# EAGLE design xv11_nucleo_shield (EAGLE 8.1.0)
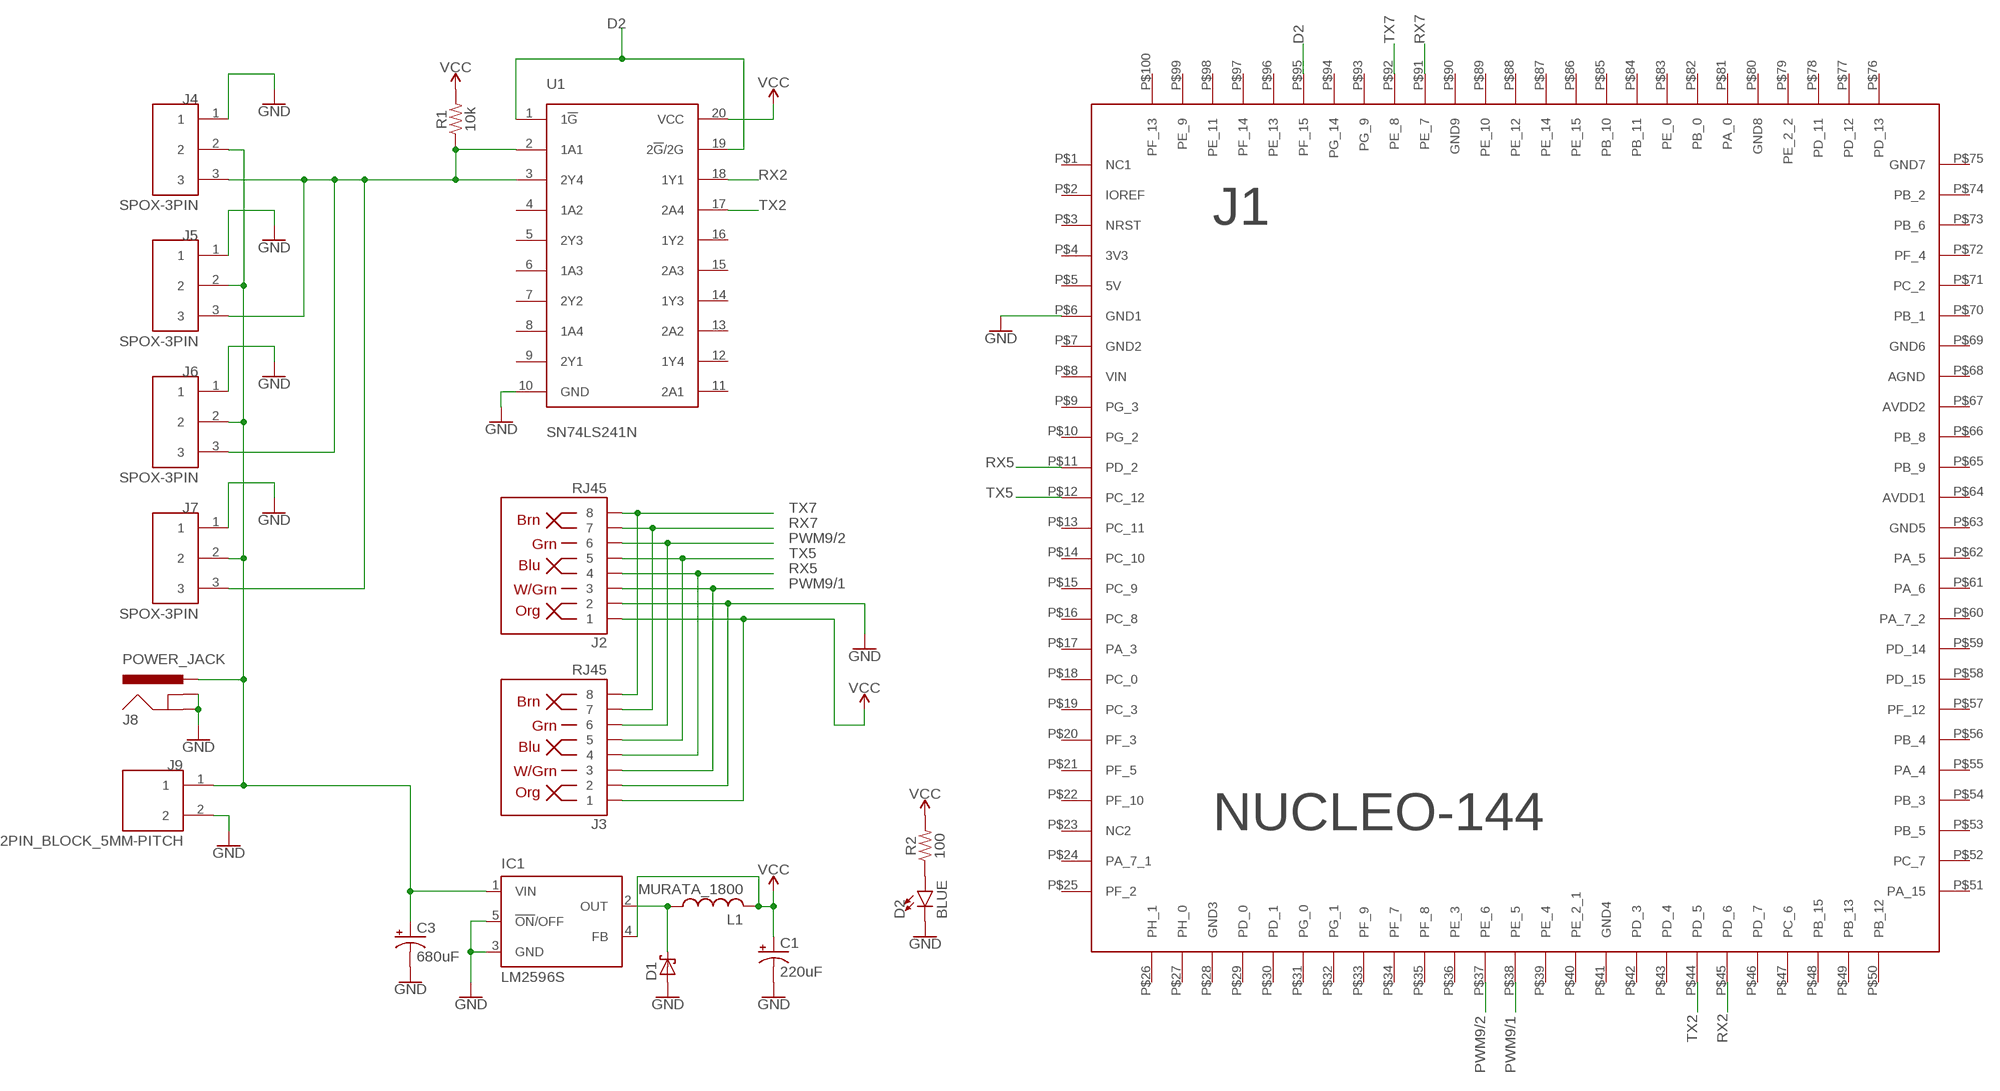
[diagram p0: schematic, sheet 1]

## Parts
C1  220uF  100UF-POLAR-RADIAL-2.5MM-25V-20%  [CPOL-RADIAL-2.5MM-6.5MM]
C3  680uF  EEU-FR1C681L  [EEU-FR1C681L]
D1  SCHOTTKY-DIODEDO201T15  [DO201T15]
D2  BLUE  LED-BLUE1206  [LED-1206]
IC1  LM2596S  [TO263-5]
J1  NUCLEO-144  [NUCLEO-144]
J2  RJ45  RJ45-8  [RJ45-8]
J3  RJ45  RJ45-8  [RJ45-8]
J4  SPOX-3PIN  [SPOX-3PIN]
J5  SPOX-3PIN  [SPOX-3PIN]
J6  SPOX-3PIN  [SPOX-3PIN]
J7  SPOX-3PIN  [SPOX-3PIN]
J8  POWER_JACK  [POWER_JACK_PTH]
J9  2PIN_BLOCK_5MM-PITCH  [2PIN_BLOCK_5MM-PITCH]
L1  MURATA_1800  [MURATA_1800]
R1  10k  10KOHM-HORIZ-1/4W-1%  [AXIAL-0.3]
R2  100  10KOHM-HORIZ-1/4W-1%  [AXIAL-0.3]
U1  SN74LS241N  [DIL20]

## Nets
D2: J1.P$95(PF_15) U1.1(1!G) U1.19(2!G!/2G)
GND: C1.2(-) C3.P$2(-) D1.A D2.C IC1.3(GND) IC1.5(!ON!/OFF) J1.P$6(GND1) J2.2 J3.2 J4.1 J5.1 J6.1 J7.1 J8.GND J8.GNDBREAK J9.2 U1.10(GND)
N$1: J4.3 J5.3 J6.3 J7.3 R1.P$1 U1.2(1A1) U1.3(2Y4)
N$2: C3.P$1(+) IC1.1(VIN) J4.2 J5.2 J6.2 J7.2 J8.PWR J9.1
N$3: D1.C IC1.2(OUT) L1.P$1
N$4: D2.A R2.P$1
PWM9/1: J1.P$38(PE_5) J2.3 J3.3
PWM9/2: J1.P$37(PE_6) J2.6 J3.6
RX2: J1.P$45(PD_6) U1.18(1Y1)
RX5: J1.P$11(PD_2) J2.4 J3.4
RX7: J1.P$91(PE_7) J2.7 J3.7
TX2: J1.P$44(PD_5) U1.17(2A4)
TX5: J1.P$12(PC_12) J2.5 J3.5
TX7: J1.P$92(PE_8) J2.8 J3.8
VCC: C1.1(+) IC1.4(FB) J2.1 J3.1 L1.P$2 R1.P$2 R2.P$2 U1.20(VCC)
Unconnected: J1.P$1(NC1) J1.P$2(IOREF) J1.P$3(NRST) J1.P$4(3V3) J1.P$5(5V) J1.P$7(GND2) J1.P$8(VIN) J1.P$9(PG_3) J1.P$10(PG_2) J1.P$13(PC_11) J1.P$14(PC_10) J1.P$15(PC_9) J1.P$16(PC_8) J1.P$17(PA_3) J1.P$18(PC_0) J1.P$19(PC_3) J1.P$20(PF_3) J1.P$21(PF_5) J1.P$22(PF_10) J1.P$23(NC2) J1.P$24(PA_7_1) J1.P$25(PF_2) J1.P$26(PH_1) J1.P$27(PH_0) J1.P$28(GND3) J1.P$29(PD_0) J1.P$30(PD_1) J1.P$31(PG_0) J1.P$32(PG_1) J1.P$33(PF_9) J1.P$34(PF_7) J1.P$35(PF_8) J1.P$36(PE_3) J1.P$39(PE_4) J1.P$40(PE_2_1) J1.P$41(GND4) J1.P$42(PD_3) J1.P$43(PD_4) J1.P$46(PD_7) J1.P$47(PC_6) J1.P$48(PB_15) J1.P$49(PB_13) J1.P$50(PB_12) J1.P$51(PA_15) J1.P$52(PC_7) J1.P$53(PB_5) J1.P$54(PB_3) J1.P$55(PA_4) J1.P$56(PB_4) J1.P$57(PF_12) J1.P$58(PD_15) J1.P$59(PD_14) J1.P$60(PA_7_2) J1.P$61(PA_6) J1.P$62(PA_5) J1.P$63(GND5) J1.P$64(AVDD1) J1.P$65(PB_9) J1.P$66(PB_8) J1.P$67(AVDD2) J1.P$68(AGND) J1.P$69(GND6) J1.P$70(PB_1) J1.P$71(PC_2) J1.P$72(PF_4) J1.P$73(PB_6) J1.P$74(PB_2) J1.P$75(GND7) J1.P$76(PD_13) J1.P$77(PD_12) J1.P$78(PD_11) J1.P$79(PE_2_2) J1.P$80(GND8) J1.P$81(PA_0) J1.P$82(PB_0) J1.P$83(PE_0) J1.P$84(PB_11) J1.P$85(PB_10) J1.P$86(PE_15) J1.P$87(PE_14) J1.P$88(PE_12) J1.P$89(PE_10) J1.P$90(GND9) J1.P$93(PG_9) J1.P$94(PG_14) J1.P$96(PE_13) J1.P$97(PF_14) J1.P$98(PE_11) J1.P$99(PE_9) J1.P$100(PF_13) U1.4(1A2) U1.5(2Y3) U1.6(1A3) U1.7(2Y2) U1.8(1A4) U1.9(2Y1) U1.11(2A1) U1.12(1Y4) U1.13(2A2) U1.14(1Y3) U1.15(2A3) U1.16(1Y2)

## Library data of the parts
C1 = SparkFun-Capacitors:100UF-POLAR: 100µF polarized capacitors A capacitor is a passive two-terminal electrical component used to store electrical energy temporarily in an electric field.; PROD_ID: CAP-08439; VALUE: 100uF
C3 = Nucleo-144:EEU-FR1C681L: Panasonic Aluminum Electrolytic Capacitor Radial 16V 680uF
D1 = adafruit:SCHOTTKY-DIODE: Schottky Diode
D2 = SparkFun-LED:LED-BLUE: Blue SMD LED Used in manufacturing of various products at SparkFun Packages: 0603 - SMD 0603 package [Product Link] <http://www.digikey.com/product-detail/en/SMLE12BC7TT86/511-1589-2-ND/1641808> 1206 - SMD1206 package [Product Link] <http://www.digikey.com/product-detail/en/lite-on-inc/LTST-C150TBKT/160-1643-1-ND/573584> SparkFun Products: ESP8266 Thing-Dev Board <https://www.sparkfun.com/products/13711> RedBoard <https://www.sparkfun.com/products/12757>; PROD_ID: DIO-09911
IC1 = national-semiconductor:LM2596: SIMPLE SWITCHER® Power Converter 150 kHz 3A Step-Down Voltage Regulator Source: http://www.national.com/ds/LM/LM2596.pdf; MF: NATIONAL SEMICONDUCTOR; MPN: LM2596S-ADJ/NOPB; OC_FARNELL: 9494367; OC_NEWARK: 41K3842
J1 = Nucleo-144:NUCLEO-144: Header footprint of an STM32 Nucleo 144 pin board for use in making shields for the board.
J2 J3 = SparkFun-Connectors:RJ45-8: RJ45 Jack - 8 pin Simple RJ45, 8-pin connection. Commonly used for Cat5, Cat5e, and Cat6 Ethernet cables. Here is the connector we sell at SparkFun: RJ45 8-Pin Connector <https://www.sparkfun.com/products/643> (PRT-00643) Datasheet <https://cdn.sparkfun.com/datasheets/Prototyping/04908.pdf> It is used on this SparkFun product: SparkFun RJ45 Breakout <https://www.sparkfun.com/products/716> (BOB-00716) Note, you may also be interested in the "MAGJACK" version of this. It is basically a RJ45 connector, but also has some status LEDs built into the connector housing. You can check that out in this library at the device named "MAGJACK.dev" and see these products online: RJ45 Ethernet MagJack-Compatible <https://www.sparkfun.com/products/8534> (PRT-08534) SparkFun RJ45 MagJack Breakout <https://www.sparkfun.com/products/13021> (BOB-13021); PROD_ID: CONN-08506; SF_ID: PRT-00643
J4-J7 = Nucleo-144:SPOX-3PIN: 3-pin MOLEX SPOX connector.
J8 = SparkFun-Connectors:POWER_JACK: Power Jack Connector This is the standard 5.5mm barrel jack for power. The PTH is the most common, proven, reliable, footprint. The Slot footprint only works if the mill layer is transmitted to the PCB fab house so be warned. Here are the connectors we sell at SparkFun: DC Barrel Power Jack/Connector <https://www.sparkfun.com/products/119> (PRT-00119) DC Barrel Power Jack/Connector (SMD) <https://www.sparkfun.com/products/12748> (PRT-12748) DC Barrel Jack Adapter - Breadboard Compatible <https://www.sparkfun.com/products/10811> (PRT-10811) It is used on this SparkFun product (and many, many others): SparkFun RedBoard - Programmed with Arduino <https://www.sparkfun.com/products/12757> (DEV-12757) Also, if you need a mating power supply or connector, please check these out: Wall Adapter Power Supply - 9VDC 650mA <https://www.sparkfun.com/products/298> (TOL-00298) DC Barrel Jack Adapter - Male <https://www.sparkfun.com/products/10287> (PRT-10287); PROD_ID: CONN-08197
J9 = Nucleo-144:2PIN_BLOCK_5MM-PITCH
L1 = Nucleo-144:MURATA_1800: Murata 1800 Series Axial Inductor
R1 = SparkFun-Resistors:10KOHM: 10kΩ resistor A resistor is a passive two-terminal electrical component that implements electrical resistance as a circuit element. Resistors act to reduce current flow, and, at the same time, act to lower voltage levels within circuits. - Wikipedia; PROD_ID: RES-12183
R2 = SparkFun-Resistors:10KOHM: 10kΩ resistor A resistor is a passive two-terminal electrical component that implements electrical resistance as a circuit element. Resistors act to reduce current flow, and, at the same time, act to lower voltage levels within circuits. - Wikipedia; PROD_ID: RES-12183; VALUE: 10k
U1 = Nucleo-144:SN74LS241N: Octal Line Buffer

## Board
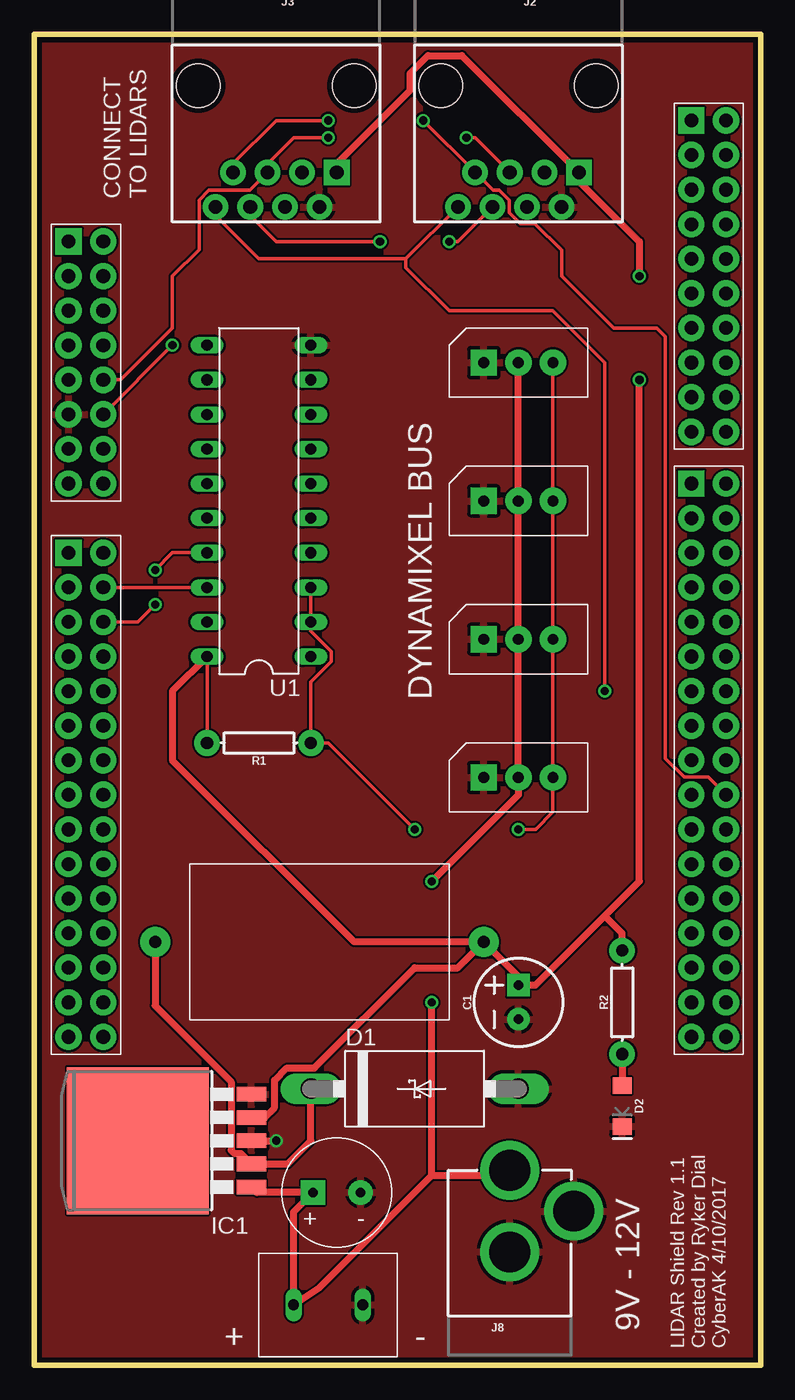
[diagram p1: board, top side]
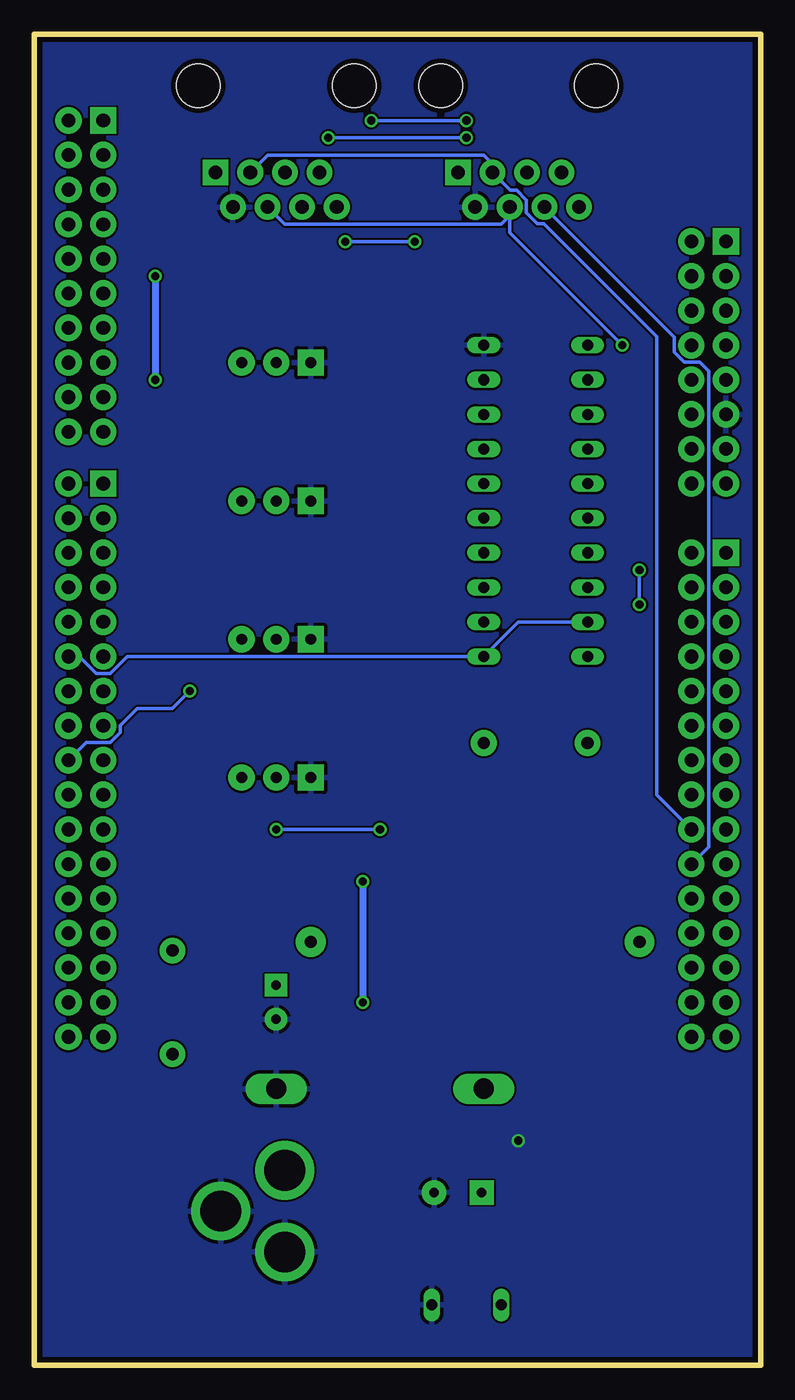
[diagram p2: board, bottom side, seen from below]

Size 53.34 x 97.79 mm. Coordinates in mm from the lower left corner, seen from the top.
Outline: 0,0 0,97.79 53.34,97.79 53.34,0 0,0
Copper layers (1*16): Top 0.0356mm / dielectric 1.5011mm / Bottom 0.0356mm
Design rules "LaenPCBOrder": minimum track width 6mil, minimum drill 13mil, track to track 6mil, track to pad 6mil, pad to pad 6mil, via to via 6mil, smd to smd 6mil, copper to edge 15mil, drill to drill 6mil, minimum pad ring 7mil, minimum via ring 7mil, stop-mask expansion 3mil, vias tented up to drill 0mil, thermal gap 10mil

### Footprints (pad centres in the part's own frame; a part is rotated, then mirrored left to right if it is on the bottom)
CPOL-RADIAL-2.5MM-6.5MM = drill 0.7 pad 1.651 square: 1 1.25,0 | drill 0.7 pad 1.651: 2 -1.25,0
EEU-FR1C681L = drill 0.7 pad 1.778 square: P$1 -1.75,0 | drill 0.7 pad 1.778: P$2 1.75,0
DO201T15 = drill 1.499 long: A 7.62,0; C -7.62,0
LED-1206 = smd 1.2 x 1.4: A -1.5,0; C 1.5,0
TO263-5 = smd 1.067 x 2.159: 1 -3.404,-5.791; 2 -1.702,-5.791; 3 0,-5.791; 4 1.702,-5.791; 5 3.404,-5.791 | smd 10.8 x 10.41: 6 0,2.54
NUCLEO-144 = drill 1 pad 1.93 square: P$1 0,0; P$17 0,-22.86; P$47 45.72,8.89; P$67 45.72,-17.78 | drill 1 pad 1.93: P$2 0,-2.54; P$3 0,-5.08; P$4 0,-7.62; P$5 0,-10.16; P$6 0,-12.7; P$7 0,-15.24; P$8 0,-17.78; P$9 2.54,-17.78; P$10 2.54,-15.24; P$11 2.54,-12.7; P$12 2.54,-10.16; P$13 2.54,-7.62; P$14 2.54,-5.08; P$15 2.54,-2.54; P$16 2.54,0; P$18 0,-25.4; P$19 0,-27.94; P$20 0,-30.48; P$21 0,-33.02; P$22 0,-35.56; P$23 0,-38.1; P$24 0,-40.64; P$25 0,-43.18; P$26 0,-45.72; P$27 0,-48.26; P$28 0,-50.8; P$29 0,-53.34; P$30 0,-55.88; P$31 0,-58.42; P$32 2.54,-58.42; P$33 2.54,-55.88; P$34 2.54,-53.34; P$35 2.54,-50.8; P$36 2.54,-48.26; P$37 2.54,-45.72; P$38 2.54,-43.18; P$39 2.54,-40.64; P$40 2.54,-38.1; P$41 2.54,-35.56; P$42 2.54,-33.02; P$43 2.54,-30.48; P$44 2.54,-27.94; P$45 2.54,-25.4; P$46 2.54,-22.86; P$48 45.72,6.35; P$49 45.72,3.81; P$50 45.72,1.27; P$51 45.72,-1.27; P$52 45.72,-3.81; P$53 45.72,-6.35; P$54 45.72,-8.89; P$55 45.72,-11.43; P$56 45.72,-13.97; P$57 48.26,-13.97; P$58 48.26,-11.43; P$59 48.26,-8.89; P$60 48.26,-6.35; P$61 48.26,-3.81; P$62 48.26,-1.27; P$63 48.26,1.27; P$64 48.26,3.81; P$65 48.26,6.35; P$66 48.26,8.89; P$68 45.72,-20.32; P$69 45.72,-22.86; P$70 45.72,-25.4; P$71 45.72,-27.94; P$72 45.72,-30.48; P$73 45.72,-33.02; P$74 45.72,-35.56; P$75 45.72,-38.1; P$76 45.72,-40.64; P$77 45.72,-43.18; P$78 45.72,-45.72; P$79 45.72,-48.26; P$80 45.72,-50.8; P$81 45.72,-53.34; P$82 45.72,-55.88; P$83 45.72,-58.42; P$84 48.26,-58.42; P$85 48.26,-55.88; P$86 48.26,-53.34; P$87 48.26,-50.8; P$88 48.26,-48.26; P$89 48.26,-45.72; P$90 48.26,-43.18; P$91 48.26,-40.64; P$92 48.26,-38.1; P$93 48.26,-35.56; P$94 48.26,-33.02; P$95 48.26,-30.48; P$96 48.26,-27.94; P$97 48.26,-25.4; P$98 48.26,-22.86; P$99 48.26,-20.32; P$100 48.26,-17.78
RJ45-8 = drill 1 pad 1.88 square: 1 -4.445,6.35 | drill 1 pad 1.88: 2 -3.175,8.89; 3 -1.905,6.35; 4 -0.635,8.89; 5 0.635,6.35; 6 1.905,8.89; 7 3.175,6.35; 8 4.445,8.89 | hole 3.2: -5.715,0; 5.715,0
SPOX-3PIN = drill 0.8 pad 1.93 square: 1 2.54,2.54 | drill 0.8 pad 1.93: 2 5.08,2.54; 3 7.62,2.54
POWER_JACK_PTH = drill 2.997 pad 4.318: GND 0,7.7; GNDBREAK 4.7,10.7; PWR 0,13.7
2PIN_BLOCK_5MM-PITCH = drill 0.8 long: 1 2.54,3.81; 2 7.62,3.81
MURATA_1800 = drill 0.9 pad 2.184: P$1 -2.54,5.715; P$2 21.59,5.715
AXIAL-0.3 = drill 0.9 pad 1.88: P$1 -3.81,0; P$2 3.81,0
DIL20 = drill 0.813 long: 1 -11.43,-3.81; 2 -8.89,-3.81; 3 -6.35,-3.81; 4 -3.81,-3.81; 5 -1.27,-3.81; 6 1.27,-3.81; 7 3.81,-3.81; 8 6.35,-3.81; 9 8.89,-3.81; 10 11.43,-3.81; 11 11.43,3.81; 12 8.89,3.81; 13 6.35,3.81; 14 3.81,3.81; 15 1.27,3.81; 16 -1.27,3.81; 17 -3.81,3.81; 18 -6.35,3.81; 19 -8.89,3.81; 20 -11.43,3.81

### Placement (x,y rotation side)
C1  35.56,26.67 90 top
C3  22.23,12.7 0 top
D1  27.94,20.32 0 top
D2  43.18,19.05 270 top
IC1  10.16,16.51 90 top
J1  2.54,82.55 0 top
J2  35.56,93.98 180 top
J3  17.78,93.98 180 top
J4  30.48,71.12 0 top
J5  30.48,60.96 0 top
J6  30.48,50.8 0 top
J7  30.48,40.64 0 top
J8  34.92,0.64 0 top
J9  16.51,0.64 0 top
L1  11.43,25.4 0 top
R1  16.51,45.72 180 top
R2  43.18,26.67 90 top
U1  16.51,63.5 90 top

### Tracks (layer width: path | path; a pad name or v marks a point on that pad's centre or on a via)
D2
  Bottom 0.254: U1.19 17.78,54.61 U1.1 46.5,52.07 47.74,50.83 48.78,50.83 50.02,52.07 J1.P$95
GND  (via drill 0.6)
  Top 0.508: IC1.3 v17.78,16.51
  pour Bottom: 53.34,0 0,0 0,97.79 53.34,97.79
  pour Top: 0,97.79 0,0 53.34,0 53.34,97.79
N$1  (via drill 0.6)
  Top 0.254: J4.3 J5.3 J6.3 J7.3 38.1,40.64 36.83,39.37 v35.56,39.37 | U1.3 U1.2 20.32,53.94 21.82,52.44 21.82,51.7 20.32,50.2 R1.P$1 21.59,45.72 v27.94,39.37
  Bottom 0.254: v27.94,39.37 v35.56,39.37
N$2  (via drill 0.6)
  Top 0.508: J4.2 J5.2 J6.2 J7.2 35.56,41.91 v29.21,35.56 | 29.21,13.97 20.95,5.71 J9.1 19.05,11.28 C3.P$1 16.36,12.7 IC1.1 | 29.21,13.97 33.29,13.97 J8.PWR | 29.21,13.97 v29.21,26.67
  Bottom 0.508: v29.21,35.56 v29.21,26.67
N$3
  Top 0.508: L1.P$1 8.89,26.42 14.46,20.84 14.46,15.81 14.7,15.57 15.19,15.57 IC1.2 18.62,14.81 20.32,16.51 D1.C
N$4
  Top 0.508: R2.P$1 D2.A
PWM9/1
  Bottom 0.254: J2.3 36.2,88.9 20.32,88.9 19.68,88.27 J3.3 18.36,86.31 17.91,86.31 17.2,85.59 17.2,84.69 16.38,83.87 15.93,83.87 7.62,75.56 7.62,41.91 J1.P$38
PWM9/2  (via drill 0.6)
  Top 0.254: J3.6 15.88,84.45 17.78,82.55 v25.4,82.55 | v30.48,82.55 31.11,82.55 J2.6
  Bottom 0.254: 15.88,84.45 J3.6 6.33,75.54 6.33,74.41 5.6,73.69 4.47,73.69 3.81,73.03 3.81,38.1 J1.P$37 | v25.4,82.55 v30.48,82.55
RX2
  Top 0.254: J1.P$45 U1.18
RX5  (via drill 0.6)
  Top 0.254: J1.P$11 v10.16,74.93
  Bottom 0.254: J2.4 34.92,83.82 19.05,83.82 18.41,84.45 J3.4 18.41,83.19 v10.16,74.93
RX7  (via drill 0.6)
  Top 0.254: J3.7 14.61,88.27 17.78,91.44 v21.59,91.44 | v28.57,91.44 J2.7 33.71,86.31 34.16,86.31 34.87,85.59 34.87,84.69 35.69,83.87 36.78,83.87 38.73,81.92 38.73,80.01 42.55,76.2 45.72,76.2 46.35,75.56 46.35,44.59 47.74,43.2 49.51,43.2 J1.P$91
  Bottom 0.254: v21.59,91.44 v28.57,91.44
TX2  (via drill 0.6)
  Top 0.254: J1.P$44 7.62,54.61 v8.89,55.88 | v8.89,58.42 10.16,59.69 U1.17
  Bottom 0.254: v8.89,55.88 v8.89,58.42
TX5  (via drill 0.6)
  Top 0.254: J1.P$12 6.35,72.39 10.16,76.2 10.16,80.01 12.12,81.97 12.12,85.59 12.83,86.31 15.82,86.31 J3.5 17.14,88.27 19.05,90.17 v21.59,90.17 | v31.75,90.17 32.38,90.17 J2.5
  Bottom 0.254: v21.59,90.17 v31.75,90.17
TX7  (via drill 0.6)
  Top 0.254: J3.8 13.34,84.45 16.51,81.28 27.3,81.28 | J2.8 27.3,81.28 | 27.3,81.28 27.3,80.64 30.48,77.47 38.1,77.47 41.91,73.66 v41.91,49.53
  Bottom 0.254: v41.91,49.53 43.18,48.26 45.75,48.26 47.02,46.99 47.02,46.47 47.74,45.75 49.51,45.75 J1.P$92
VCC  (via drill 0.6)
  Top 0.254: R1.P$2 U1.20
  Top 0.508: J3.1 22.23,88.27 27.61,93.65 27.61,94.91 28.92,96.22 31.42,96.22 J2.1 40.01,87 44.45,82.55 v44.45,80.01 | U1.20 10.16,49.53 10.16,44.45 23.5,31.12 L1.P$2 | v44.45,72.39 44.45,35.56 41.91,33.02 | 41.91,33.02 36.81,27.92 C1.1 35.56,28.57 L1.P$2 | IC1.4 16.94,18.21 17.67,18.94 17.67,20.95 18.56,21.85 20.58,21.85 27.94,29.21 31.11,29.21 L1.P$2 | R2.P$2 43.18,31.75 41.91,33.02
  Bottom 0.508: v44.45,80.01 v44.45,72.39

### Text on the board
tPlace: CONNECT / TO LIDARS | DYNAMIXEL BUS | 9V - 12V | + | - | LIDAR Shield Rev 1.1 / Created by Ryker Dial / CyberAK 4/10/2017